# Altium project dsau-motherboard-revA.PrjPcb (part 2 of 2)

## Sheet dsau-micro-zed-bank35.SchDoc: dSAU Motherboard - uZed BANK35
size Letter; Engineer: Christopher J. Woodall; Organization: Boston University EDF/ECE; DocumentNumber: 9; Revision: A; SheetNumber: 9; SheetTotal: 10; EMAIL: cwoodall@bu.edu; TeamName: Team 19; ProjectName: dSAU
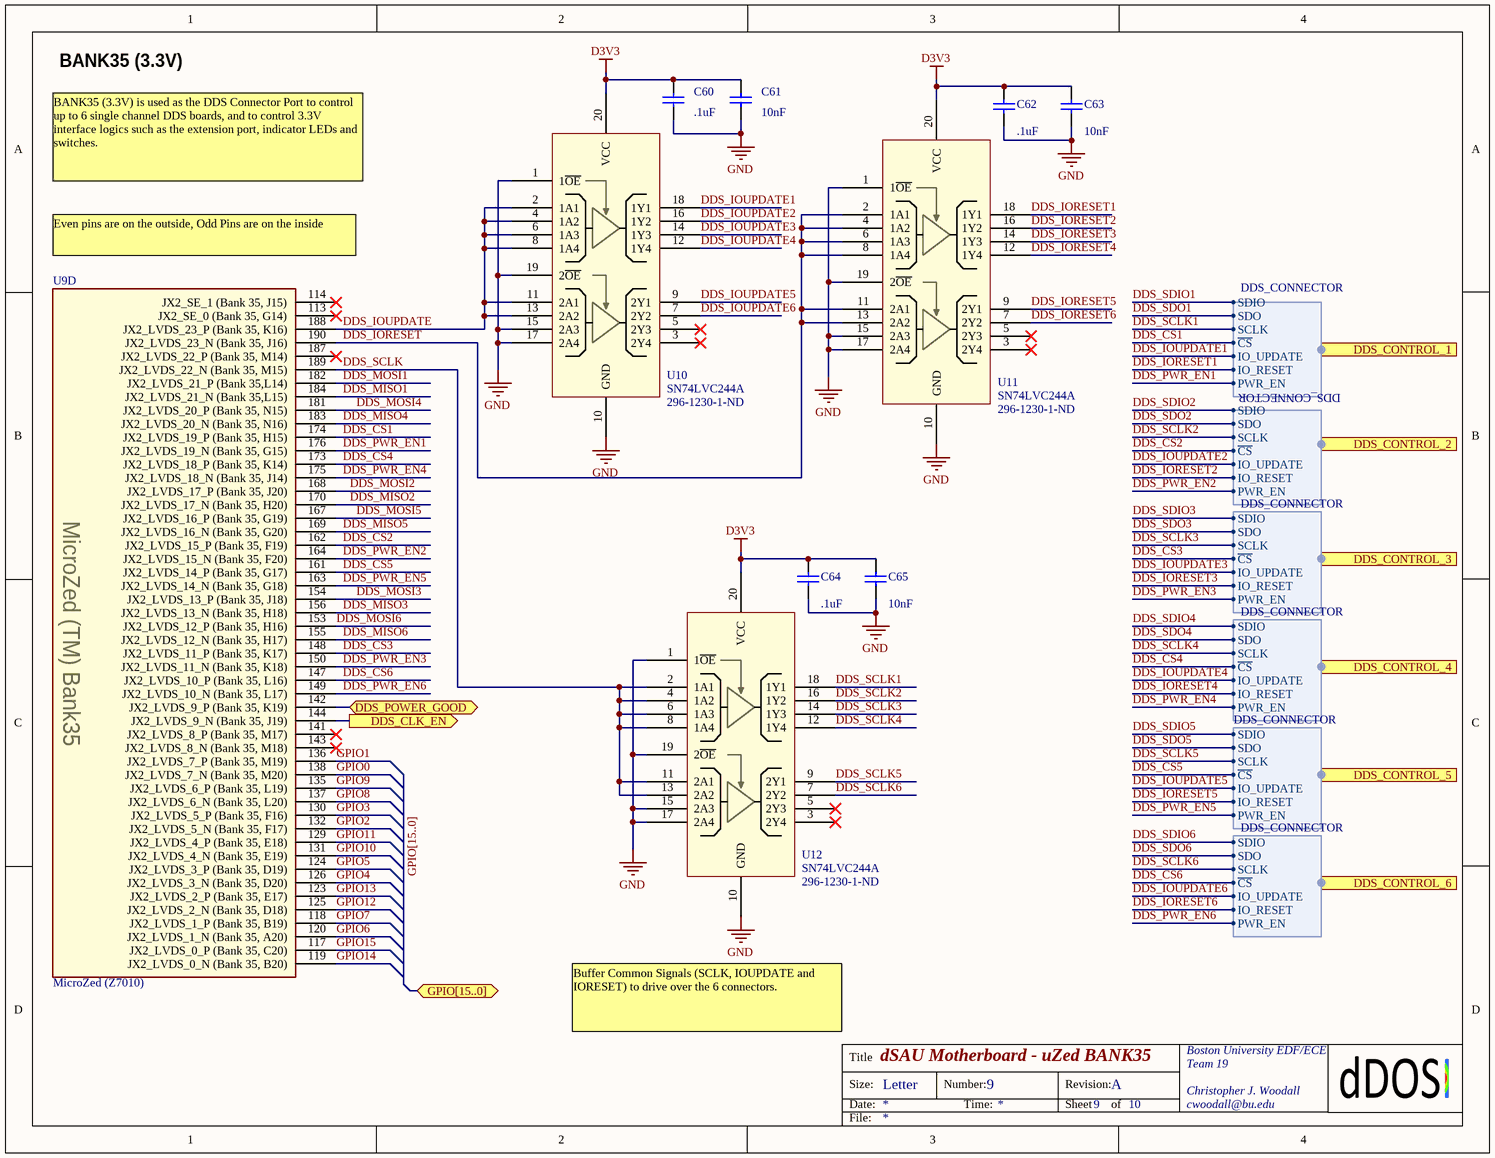
[diagram p6: dsau-micro-zed-bank35.SchDoc]

### Parts
C60  value .1uF  [CAPC1608L]  (hidden comment: CER 0.1UF 50V Y5V)
C61  value 10nF  [CAPC1608L]  (hidden comment: CER 10NF 25V 10% NP0)
C62  value .1uF  [CAPC1608L]  (hidden comment: CER 0.1UF 50V Y5V)
C63  value 10nF  [CAPC1608L]  (hidden comment: CER 10NF 25V 10% NP0)
C64  value .1uF  [CAPC1608L]  (hidden comment: CER 0.1UF 50V Y5V)
C65  value 10nF  [CAPC1608L]  (hidden comment: CER 10NF 25V 10% NP0)
U9  MicroZed (Z7010)  [MicroZed_MatingSide]  (part D of 5)
U10  SN74LVC244A  Supplier Part Number 1: 296-1230-1-ND  [TSOP64P640X120-20N]
U11  SN74LVC244A  Supplier Part Number 1: 296-1230-1-ND  [TSOP64P640X120-20N]
U12  SN74LVC244A  Supplier Part Number 1: 296-1230-1-ND  [TSOP64P640X120-20N]

### Ports
DDS_CLK_EN (out), DDS_CONTROL_1 (harness DDS_CONNECTOR), DDS_CONTROL_2 (harness DDS_CONNECTOR), DDS_CONTROL_3 (harness DDS_CONNECTOR), DDS_CONTROL_4 (harness DDS_CONNECTOR), DDS_CONTROL_5 (harness DDS_CONNECTOR), DDS_CONTROL_6 (harness DDS_CONNECTOR), DDS_POWER_GOOD, GPIO[15..0] (bidir)

### Harnesses
DDS_CONNECTOR: SDIO, SDO, SCLK, ~{CS}, IO_UPDATE, IO_RESET, PWR_EN

### Nets
D3V3: C60.2 C61.1 C62.2 C63.1 C64.2 C65.1 U10.20(VCC) U11.20(VCC) U12.20(VCC)
GND: C60.1 C61.2 C62.1 C63.2 C64.1 C65.2 U10.1(1~{OE}) U10.10(GND) U10.15(2A3) U10.17(2A4) U10.19(2~{OE}) U11.1(1~{OE}) U11.10(GND) U11.15(2A3) U11.17(2A4) U11.19(2~{OE}) U12.1(1~{OE}) U12.10(GND) U12.15(2A3) U12.17(2A4) U12.19(2~{OE})
DDS_CS1: U9.174(JX2_LVDS_19_P_(Bank_35,_H15)) ; port DDS_CONTROL_1.~{CS}
DDS_CS2: U9.162(JX2_LVDS_15_P_(Bank_35,_F19)) ; port DDS_CONTROL_2.~{CS}
DDS_CS3: U9.148(JX2_LVDS_11_P_(Bank_35,_K17)) ; port DDS_CONTROL_3.~{CS}
DDS_CS4: U9.173(JX2_LVDS_18_P_(Bank_35,_K14)) ; port DDS_CONTROL_4.~{CS}
DDS_CS5: U9.161(JX2_LVDS_14_P_(Bank_35,_G17)) ; port DDS_CONTROL_5.~{CS}
DDS_CS6: U9.147(JX2_LVDS_10_P_(Bank_35,_L16)) ; port DDS_CONTROL_6.~{CS}
DDS_IORESET: U9.190(JX2_LVDS_23_N_(Bank_35,_J16)) U11.2(1A1) U11.4(1A2) U11.6(1A3) U11.8(1A4) U11.11(2A1) U11.13(2A2)
DDS_IORESET1: U11.18(1Y1) ; port DDS_CONTROL_1.IO_RESET
DDS_IORESET2: U11.16(1Y2) ; port DDS_CONTROL_2.IO_RESET
DDS_IORESET3: U11.14(1Y3) ; port DDS_CONTROL_3.IO_RESET
DDS_IORESET4: U11.12(1Y4) ; port DDS_CONTROL_4.IO_RESET
DDS_IORESET5: U11.9(2Y1) ; port DDS_CONTROL_5.IO_RESET
DDS_IORESET6: U11.7(2Y2) ; port DDS_CONTROL_6.IO_RESET
DDS_IOUPDATE: U9.188(JX2_LVDS_23_P_(Bank_35,_K16)) U10.2(1A1) U10.4(1A2) U10.6(1A3) U10.8(1A4) U10.11(2A1) U10.13(2A2)
DDS_IOUPDATE1: U10.18(1Y1) ; port DDS_CONTROL_1.IO_UPDATE
DDS_IOUPDATE2: U10.16(1Y2) ; port DDS_CONTROL_2.IO_UPDATE
DDS_IOUPDATE3: U10.14(1Y3) ; port DDS_CONTROL_3.IO_UPDATE
DDS_IOUPDATE4: U10.12(1Y4) ; port DDS_CONTROL_4.IO_UPDATE
DDS_IOUPDATE5: U10.9(2Y1) ; port DDS_CONTROL_5.IO_UPDATE
DDS_IOUPDATE6: U10.7(2Y2) ; port DDS_CONTROL_6.IO_UPDATE
DDS_MISO1: U9.184(JX2_LVDS_21_N_(Bank_35,L15))
DDS_MISO2: U9.170(JX2_LVDS_17_N_(Bank_35,_H20))
DDS_MISO3: U9.156(JX2_LVDS_13_N_(Bank_35,_H18))
DDS_MISO4: U9.183(JX2_LVDS_20_N_(Bank_35,_N16))
DDS_MISO5: U9.169(JX2_LVDS_16_N_(Bank_35,_G20))
DDS_MISO6: U9.155(JX2_LVDS_12_N_(Bank_35,_H17))
DDS_MOSI1: U9.182(JX2_LVDS_21_P_(Bank_35,L14))
DDS_MOSI2: U9.168(JX2_LVDS_17_P_(Bank_35,_J20))
DDS_MOSI3: U9.154(JX2_LVDS_13_P_(Bank_35,_J18))
DDS_MOSI4: U9.181(JX2_LVDS_20_P_(Bank_35,_N15))
DDS_MOSI5: U9.167(JX2_LVDS_16_P_(Bank_35,_G19))
DDS_MOSI6: U9.153(JX2_LVDS_12_P_(Bank_35,_H16))
DDS_PWR_EN1: U9.176(JX2_LVDS_19_N_(Bank_35,_G15)) ; port DDS_CONTROL_1.PWR_EN
DDS_PWR_EN2: U9.164(JX2_LVDS_15_N_(Bank_35,_F20)) ; port DDS_CONTROL_2.PWR_EN
DDS_PWR_EN3: U9.150(JX2_LVDS_11_N_(Bank_35,_K18)) ; port DDS_CONTROL_3.PWR_EN
DDS_PWR_EN4: U9.175(JX2_LVDS_18_N_(Bank_35,_J14)) ; port DDS_CONTROL_4.PWR_EN
DDS_PWR_EN5: U9.163(JX2_LVDS_14_N_(Bank_35,_G18)) ; port DDS_CONTROL_5.PWR_EN
DDS_PWR_EN6: U9.149(JX2_LVDS_10_N_(Bank_35,_L17)) ; port DDS_CONTROL_6.PWR_EN
DDS_SCLK: U9.189(JX2_LVDS_22_N_(Bank_35,_M15)) U12.2(1A1) U12.4(1A2) U12.6(1A3) U12.8(1A4) U12.11(2A1) U12.13(2A2)
DDS_SCLK1: U12.18(1Y1) ; port DDS_CONTROL_1.SCLK
DDS_SCLK2: U12.16(1Y2) ; port DDS_CONTROL_2.SCLK
DDS_SCLK3: U12.14(1Y3) ; port DDS_CONTROL_3.SCLK
DDS_SCLK4: U12.12(1Y4) ; port DDS_CONTROL_4.SCLK
DDS_SCLK5: U12.9(2Y1) ; port DDS_CONTROL_5.SCLK
DDS_SCLK6: U12.7(2Y2) ; port DDS_CONTROL_6.SCLK
GPIO0: U9.138(JX2_LVDS_7_N_(Bank_35,_M20))
GPIO1: U9.136(JX2_LVDS_7_P_(Bank_35,_M19))
GPIO2: U9.132(JX2_LVDS_5_N_(Bank_35,_F17))
GPIO3: U9.130(JX2_LVDS_5_P_(Bank_35,_F16))
GPIO4: U9.126(JX2_LVDS_3_N_(Bank_35,_D20))
GPIO5: U9.124(JX2_LVDS_3_P_(Bank_35,_D19))
GPIO6: U9.120(JX2_LVDS_1_N_(Bank_35,_A20))
GPIO7: U9.118(JX2_LVDS_1_P_(Bank_35,_B19))
GPIO8: U9.137(JX2_LVDS_6_N_(Bank_35,_L20))
GPIO9: U9.135(JX2_LVDS_6_P_(Bank_35,_L19))
GPIO10: U9.131(JX2_LVDS_4_N_(Bank_35,_E19))
GPIO11: U9.129(JX2_LVDS_4_P_(Bank_35,_E18))
GPIO12: U9.125(JX2_LVDS_2_N_(Bank_35,_D18))
GPIO13: U9.123(JX2_LVDS_2_P_(Bank_35,_E17))
GPIO14: U9.119(JX2_LVDS_0_N_(Bank_35,_B20))
GPIO15: U9.117(JX2_LVDS_0_P_(Bank_35,_C20))
NetJ1_1_8: U9.142(JX2_LVDS_9_P_(Bank_35,_K19)) ; port DDS_POWER_GOOD
NetJP5_3: U9.144(JX2_LVDS_9_N_(Bank_35,_J19)) ; port DDS_CLK_EN

Not connected (* = marked no-connect by the designer): U9 113(JX2_SE_0_(Bank_35,_G14))* 114(JX2_SE_1_(Bank_35,_J15))* 141(JX2_LVDS_8_P_(Bank_35,_M17))* 143(JX2_LVDS_8_N_(Bank_35,_M18))* 187(JX2_LVDS_22_P_(Bank_35,_M14))*; U10 3(2Y4)* 5(2Y3)*; U11 3(2Y4)* 5(2Y3)*; U12 3(2Y4)* 5(2Y3)*

### Buses and harness runs
bus GPIO[15..0] = port GPIO[15..0]

### Notes on the sheet
- BANK35 (3.3V)
- BANK35 (3.3V) is used as the DDS Connector Port to control up to 6 single channel DDS boards, and to control 3.3V interface logics such as the extension port, indicator LEDs and switches.
- (near U9) Even pins are on the outside, Odd Pins are on the inside
- Buffer Common Signals (SCLK, IOUPDATE and IORESET) to drive over the 6 connectors.
- Title
- Size:
- Date:
- Letter
- Number:
- Time:
- Revision:
- Sheet
- of
- File:
- (in symbol MicroZed, part D) MicroZed (TM) Bank35

### Library data of the parts
C60 C62 C64 = Cap: as C5 on sheet dsau-adc; Published: 8-Jun-2000; LatestRevisionDate: 17-Jul-2002; LatestRevisionNote: Re-released for DXP Platform.; PackageReference: RAD-0.3; Publisher: Altium Limited; Supplier 1: Digi-Key; Supplier Part Number 1: 311-1343-1-ND
C61 C63 C65 = Cap: Capacitor; Manufacturer: Kemet; Manufacturer Part Number: C0603C103K3GACTU; Published: 8-Jun-2000; LatestRevisionDate: 17-Jul-2002; LatestRevisionNote: Re-released for DXP Platform.; PackageReference: RAD-0.3; Publisher: Altium Limited; Supplier 1: Digi-Key; Supplier Part Number 1: 399-8987-1-ND
U9 = MicroZed: MicroZed is a low-cost development board based on the Xilinx Zynq-7000 All Programmable SoC. Its unique design allows it to be used as both a stand-alone evaluation board for basic SoC experimentation, or combined with a carrier card as an embeddable syst; Manufacturer: Avnet; Manfacturer Part Number: AES-Z7MB-7Z010-G; Supplier 1: Avnet; Supplier Part Number 1: AES-Z7MB-7Z010-G; Supplier 2: Mouser; Supplier Part Number 2: 649-61083-101400LF
U10-U12 = SN74LVC244A: This octal buffer/line driver is operational at 1.5-V to  3.6-V V CC , but is designed specifically for 1.65-V to  3.6-V V CC operation; Manufacturer: Texas Instruments; Supplier 1: Digi-key; Manufacturer Part Number: SN74LVC244A

## Sheet dsau-dds-connector.SchDoc: dSAU Motherboard - DDS Connector
size Letter; Engineer: Christopher J. Woodall; Organization: Boston University EDF/ECE; DocumentNumber: 6; Revision: A; SheetNumber: 6; SheetTotal: 10; EMAIL: cwoodall@bu.edu; TeamName: Team 19; ProjectName: dSAU
Used 6 times, as channels DDSCONN1, DDSCONN2, DDSCONN3, DDSCONN4, DDSCONN5, DDSCONN6. Parts and nets are listed once, with the designators drawn on the sheet.
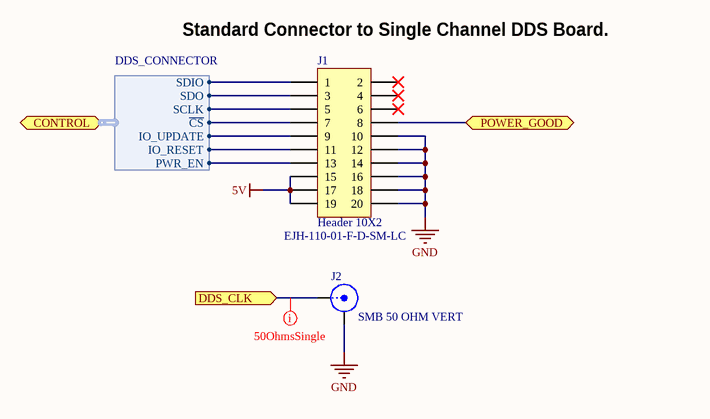
[diagram p7: dsau-dds-connector.SchDoc]

### Parts
J1  Header 10X2  Supplier Part Number 1: EJH-110-01-F-D-SM-LC  [HDR2X10]
J2  SMB 50 OHM VERT  [MOLEX_SMBVERT_731000207]

### Ports
CONTROL (harness DDS_CONNECTOR), DDS_CLK (in), POWER_GOOD

### Harnesses
DDS_CONNECTOR: SDIO, SDO, SCLK, ~{CS}, IO_UPDATE, IO_RESET, PWR_EN

### Nets
5V: J1.15 J1.17 J1.19
GND: J1.10 J1.12 J1.14 J1.16 J1.18 J1.20 J2.2(Y)
DDS_CLK: J2.1(X) ; port DDS_CLK
POWER_GOOD: J1.8 ; port POWER_GOOD
NetJ1_1: J1.1 ; port CONTROL.SDIO
NetJ1_3: J1.3 ; port CONTROL.SDO
NetJ1_5: J1.5 ; port CONTROL.SCLK
NetJ1_7: J1.7 ; port CONTROL.~{CS}
NetJ1_9: J1.9 ; port CONTROL.IO_UPDATE
NetJ1_11: J1.11 ; port CONTROL.IO_RESET
NetJ1_13: J1.13 ; port CONTROL.PWR_EN

Not connected (* = marked no-connect by the designer): J1 2* 4* 6*

### Channels
DDSCONN1: designators end in _1; ports DDS_CLK=CLK_OUT0 POWER_GOOD=NetJ1_1_8
DDSCONN2: designators end in _2; ports DDS_CLK=CLK_OUT1 POWER_GOOD=NetJ1_1_8
DDSCONN3: designators end in _3; ports DDS_CLK=CLK_OUT2 POWER_GOOD=NetJ1_1_8
DDSCONN4: designators end in _4; ports DDS_CLK=CLK_OUT3 POWER_GOOD=NetJ1_1_8
DDSCONN5: designators end in _5; ports DDS_CLK=CLK_OUT4 POWER_GOOD=NetJ1_1_8
DDSCONN6: designators end in _6; ports DDS_CLK=CLK_OUT5 POWER_GOOD=NetJ1_1_8

### Layout directives
net class 50OhmsSingle: CLK_OUT0

### Notes on the sheet
- (near J1) Standard Connector to Single Channel DDS Board.
- Title
- Size:
- Date:
- Letter
- Number:
- Time:
- Revision:
- Sheet
- of
- File:

### Library data of the parts
J1 = Header 10X2: Header, 10-Pin, Dual row; Manufacturer: Samtec; LatestRevisionDate: 17-Jul-2002; LatestRevisionNote: Re-released for DXP Platform.; Publisher: Altium Limited; Manufacturer Part Number: EJH-110-01-F-D-SM-LC; Supplier 1: Samtec; Supplier Additional: Samtec; Supplier Part Number Alternative: HCSD-05-S-02.01-01-N
J2 = SMB: SMB Straight Connector; Manufacturer: Molex Inc; Manufacturer Part Number: 0731000207; LatestRevisionDate: 17-Jul-2002; LatestRevisionNote: Re-released for DXP Platform.; Publisher: Altium Limited; Supplier 1: Digi-Key; Supplier Part Number 1: WM5528-ND

## Sheet dsau-interfaces.SchDoc: dSAU Motherboard - LEDs/Switches
size Letter; Engineer: Christopher J. Woodall; Organization: Boston University EDF/ECE; DocumentNumber: 10; Revision: A; SheetNumber: 10; SheetTotal: 10; EMAIL: cwoodall@bu.edu; TeamName: Team 19; ProjectName: dSAU
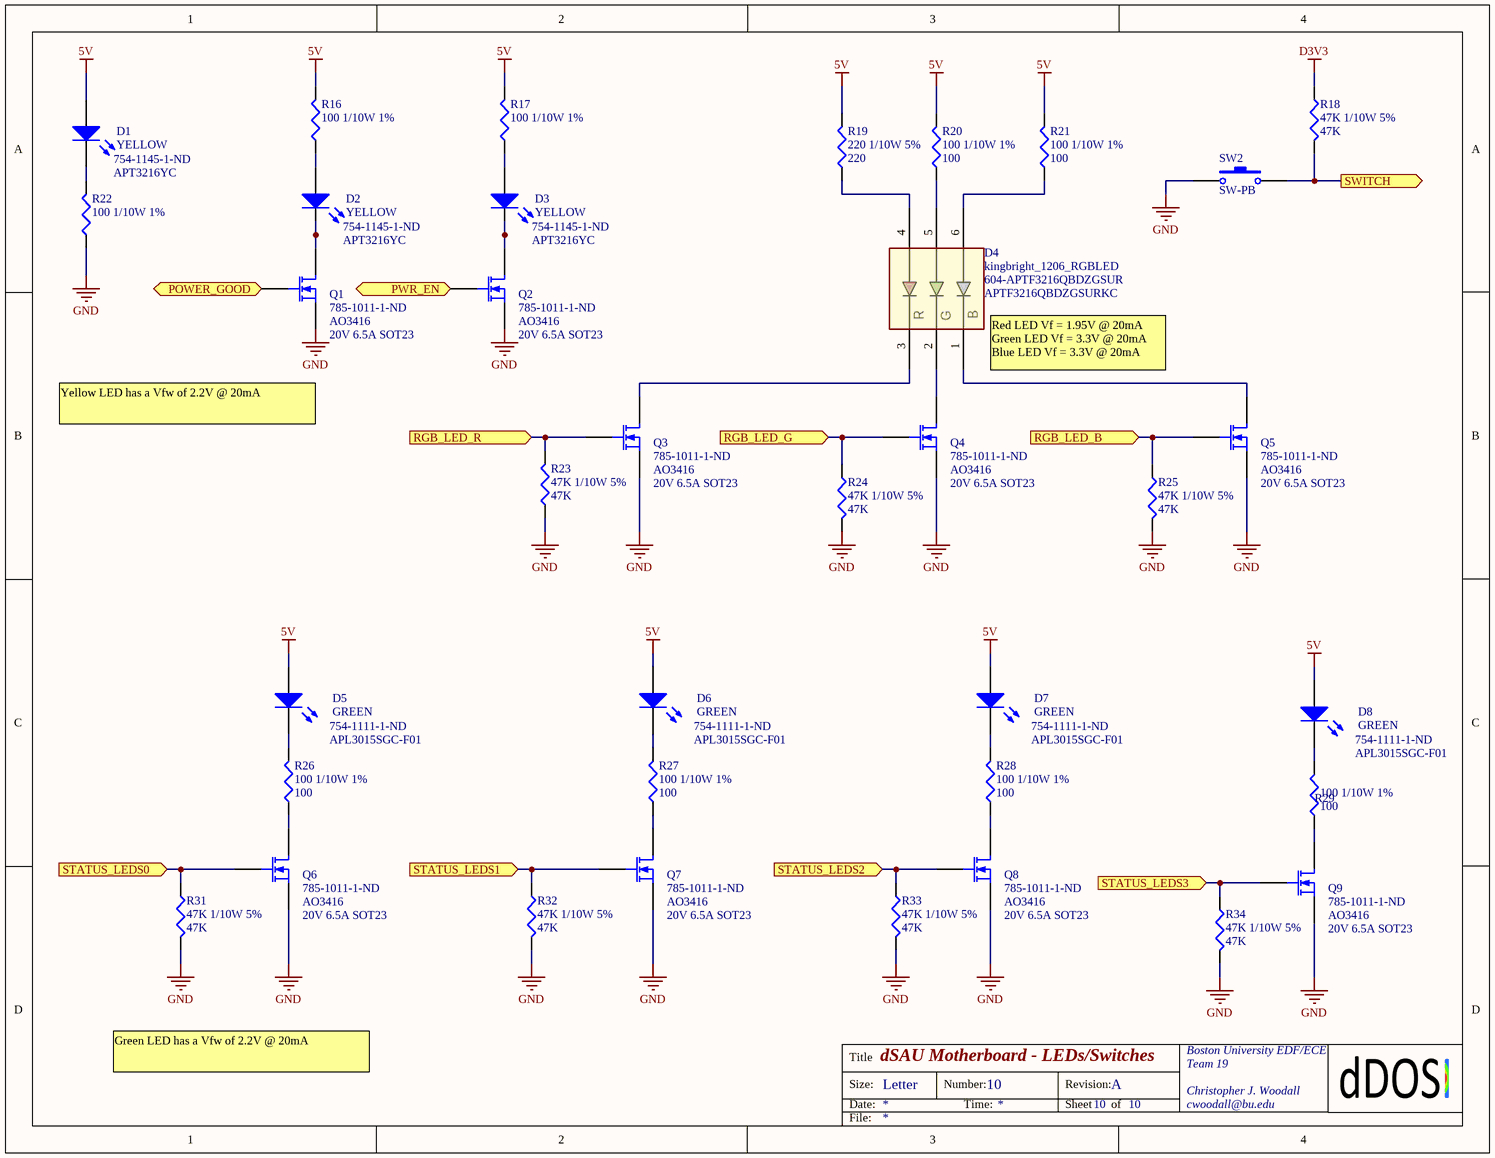
[diagram p8: dsau-interfaces.SchDoc]

### Parts
D1  YELLOW  Manufacturer Part Number: APT3216YC  Supplier Part Number 1: 754-1145-1-ND  [LED3216X08M]
D2  YELLOW  Manufacturer Part Number: APT3216YC  Supplier Part Number 1: 754-1145-1-ND  [LED3216X08M]
D3  YELLOW  Manufacturer Part Number: APT3216YC  Supplier Part Number 1: 754-1145-1-ND  [LED3216X08M]
D4  kingbright_1206_RGBLED  Supplier Part Number 1: 604-APTF3216QBDZGSUR  Manufacturer Part Number: APTF3216QBDZGSURKC  [RGBLED_1206_KINGSBRIGHT]
D5  GREEN  Manufacturer Part Number: APL3015SGC-F01  Supplier Part Number 1: 754-1111-1-ND  [LED3216X08M]
D6  GREEN  Manufacturer Part Number: APL3015SGC-F01  Supplier Part Number 1: 754-1111-1-ND  [LED3216X08M]
D7  GREEN  Manufacturer Part Number: APL3015SGC-F01  Supplier Part Number 1: 754-1111-1-ND  [LED3216X08M]
D8  GREEN  Manufacturer Part Number: APL3015SGC-F01  Supplier Part Number 1: 754-1111-1-ND  [LED3216X08M]
Q1  20V 6.5A SOT23  Manufacturer Part Number: AO3416  Supplier Part Number 1: 785-1011-1-ND  [SOT95P305X200-3M]
Q2  20V 6.5A SOT23  Manufacturer Part Number: AO3416  Supplier Part Number 1: 785-1011-1-ND  [SOT95P305X200-3M]
Q3  20V 6.5A SOT23  Manufacturer Part Number: AO3416  Supplier Part Number 1: 785-1011-1-ND  [SOT95P305X200-3M]
Q4  20V 6.5A SOT23  Manufacturer Part Number: AO3416  Supplier Part Number 1: 785-1011-1-ND  [SOT95P305X200-3M]
Q5  20V 6.5A SOT23  Manufacturer Part Number: AO3416  Supplier Part Number 1: 785-1011-1-ND  [SOT95P305X200-3M]
Q6  20V 6.5A SOT23  Manufacturer Part Number: AO3416  Supplier Part Number 1: 785-1011-1-ND  [SOT95P305X200-3M]
Q7  20V 6.5A SOT23  Manufacturer Part Number: AO3416  Supplier Part Number 1: 785-1011-1-ND  [SOT95P305X200-3M]
Q8  20V 6.5A SOT23  Manufacturer Part Number: AO3416  Supplier Part Number 1: 785-1011-1-ND  [SOT95P305X200-3M]
Q9  20V 6.5A SOT23  Manufacturer Part Number: AO3416  Supplier Part Number 1: 785-1011-1-ND  [SOT95P305X200-3M]
R16  100 1/10W 1%  [RESC1608L]
R17  100 1/10W 1%  [RESC1608L]
R18  47K 1/10W 5%  value 47K  [RESC1608L]
R19  220 1/10W 5%  value 220  [RESC1608L]
R20  100 1/10W 1%  value 100  [RESC1608L]
R21  100 1/10W 1%  value 100  [RESC1608L]
R22  100 1/10W 1%  [RESC1608L]
R23  47K 1/10W 5%  value 47K  [RESC1608L]
R24  47K 1/10W 5%  value 47K  [RESC1608L]
R25  47K 1/10W 5%  value 47K  [RESC1608L]
R26  100 1/10W 1%  value 100  [RESC1608L]
R27  100 1/10W 1%  value 100  [RESC1608L]
R28  100 1/10W 1%  value 100  [RESC1608L]
R29  100 1/10W 1%  value 100  [RESC1608L]
R31  47K 1/10W 5%  value 47K  [RESC1608L]
R32  47K 1/10W 5%  value 47K  [RESC1608L]
R33  47K 1/10W 5%  value 47K  [RESC1608L]
R34  47K 1/10W 5%  value 47K  [RESC1608L]
SW2  SW-PB  [SPST_SW_FSM4JH]

### Ports
POWER_GOOD (in), PWR_EN (in), RGB_LED_B (in), RGB_LED_G (in), RGB_LED_R (in), STATUS_LEDS0 (in), STATUS_LEDS1 (in), STATUS_LEDS2 (in), STATUS_LEDS3 (in), SWITCH (out)

### Nets
5V: D1.1(A) D5.1(A) D6.1(A) D7.1(A) D8.1(A) R16.2 R17.2 R19.2 R20.2 R21.2
D3V3: R18.1
GND: Q1.2(S) Q2.2(S) Q3.2(S) Q4.2(S) Q5.2(S) Q6.2(S) Q7.2(S) Q8.2(S) Q9.2(S) R22.1 R23.1 R24.2 R25.2 R31.2 R32.2 R33.2 R34.2 SW2.2
POWER_GOOD: Q1.1(G) ; port POWER_GOOD
PWR_EN: Q2.1(G) ; port PWR_EN
NetD1_2: D1.2(K) R22.2
NetD2_1: D2.1(A) R16.1
NetD2_2: D2.2(K) Q1.3(D)
NetD3_1: D3.1(A) R17.1
NetD3_2: D3.2(K) Q2.3(D)
NetD4_1: D4.1(B_N) Q5.3(D)
NetD4_2: D4.2(G_N) Q4.3(D)
NetD4_3: D4.3(R_N) Q3.3(D)
NetD4_4: D4.4(R_P) R19.1
NetD4_5: D4.5(G_P) R20.1
NetD4_6: D4.6(B_P) R21.1
NetD5_2: D5.2(K) R26.2
NetD6_2: D6.2(K) R27.2
NetD7_2: D7.2(K) R28.2
NetD8_2: D8.2(K) R29.2
NetQ3_1: Q3.1(G) R23.2 ; port RGB_LED_R
NetQ4_1: Q4.1(G) R24.1 ; port RGB_LED_G
NetQ5_1: Q5.1(G) R25.1 ; port RGB_LED_B
NetQ6_1: Q6.1(G) R31.1 ; port STATUS_LEDS0
NetQ6_3: Q6.3(D) R26.1
NetQ7_1: Q7.1(G) R32.1 ; port STATUS_LEDS1
NetQ7_3: Q7.3(D) R27.1
NetQ8_1: Q8.1(G) R33.1 ; port STATUS_LEDS2
NetQ8_3: Q8.3(D) R28.1
NetQ9_1: Q9.1(G) R34.1 ; port STATUS_LEDS3
NetQ9_3: Q9.3(D) R29.1
NetR18_2: R18.2 SW2.1 ; port SWITCH

### Notes on the sheet
- (near D4) Red LED Vf = 1.95V @ 20mA
  Green LED Vf = 3.3V @ 20mA
  Blue LED Vf = 3.3V @ 20mA
- Yellow LED has a Vfw of 2.2V @ 20mA
- Green LED has a Vfw of 2.2V @ 20mA
- Title
- Size:
- Date:
- Letter
- Number:
- Time:
- Revision:
- Sheet
- of
- File:
- (in symbol kingbright_1206_RGBLED) R; G; B

### Library data of the parts
D1-D3 D5-D8 = LED0: Typical INFRARED GaAs LED; Manufacturer: Kingbright Company LLC; Published: 8-Jun-2000; LatestRevisionDate: 08-Jul-2005; LatestRevisionNote: Mech Layer 1 removed.; PackageReference: LED-0; Publisher: Altium Limited; Supplier 1: Digi-Key
D4 = kingbright_1206_RGBLED: The Blue source color devices are made with InGaN Light     Emitting Diode.     The Green source color devices are made with InGaN     on Sapphire Light Emitting Diode.     The Hyper Red source color devices are made with Al-  GaInP on GaAs substrate Ligh; Supplier 1: Mouser; Manufacturer: Kingbright
Q1-Q9 = MOSFET-N: N-Channel MOSFET 1.8V Logic Level; Manufacturer: Alpha & Omega Semiconductor Inc; Value: AO3416; Published: 8-Jun-2000; LatestRevisionDate: 17-Jul-2002; LatestRevisionNote: Re-released for DXP Platform.; PackageVersion: 1995/1996; PackageReference: E3; Publisher: Altium Limited; Supplier 1: Digi-Key
R16 R17 R22 = Res3: Resistor; Manufacturer: Yageo; Manufacturer Part Number: RC0603FR-07100RL; Value: 470; Published: 8-Jun-2000; LatestRevisionDate: 29-May-2009; LatestRevisionNote: IPC-7351 Footprint Added.; PackageReference: J1-0603; Publisher: Altium Limited; PackageDescription: Chip Resistor; Supplier 1: Digi-Key; Supplier Part Number 1: 311-100HRCT-ND
R18 R23-R25 R31-R34 = Res3: as R5 on sheet dsau-motherboard-top; Published: 8-Jun-2000; LatestRevisionDate: 29-May-2009; LatestRevisionNote: IPC-7351 Footprint Added.; PackageReference: J1-0603; Publisher: Altium Limited; PackageDescription: Chip Resistor; Supplier 1: Digi-Key; Supplier Part Number 1: 311-47KGRTR-ND
R19 = Res3: Resistor; Manufacturer: Yageo; Manufacturer Part Number: RC0603FR-07220RL; Published: 8-Jun-2000; LatestRevisionDate: 29-May-2009; LatestRevisionNote: IPC-7351 Footprint Added.; PackageReference: J1-0603; Publisher: Altium Limited; PackageDescription: Chip Resistor; Supplier 1: Digi-Key; Supplier Part Number 1: 311-220HRCT-ND
R20 R21 R26-R29 = Res3: as R3 on sheet dsau-adc; Published: 8-Jun-2000; LatestRevisionDate: 29-May-2009; LatestRevisionNote: IPC-7351 Footprint Added.; PackageReference: J1-0603; Publisher: Altium Limited; PackageDescription: Chip Resistor; Supplier 1: Digi-Key; Supplier Part Number 1: 311-100HRCT-ND
SW2 = SW-PB: Switch; Manufacturer: TE Connectivity; Manufacturer Part Number: FSM4JH; Published: 24-Mar-1999; LatestRevisionDate: 17-Jul-2002; LatestRevisionNote: Re-released for DXP Platform.; PackageReference: SPST-2; Publisher: Altium Limited; Supplier 1: Digi-Key; Supplier Part Number 1: 450-1650-ND

## Sheet dsau-dds-clock.SchDoc: dSAU Motherboard - DDS Clock Gen.
size Letter; Engineer: Christopher J. Woodall; Organization: Boston University EDF/ECE; DocumentNumber: 5; Revision: A; SheetNumber: 5; SheetTotal: 10; EMAIL: cwoodall@bu.edu; TeamName: Team 19; ProjectName: dSAU
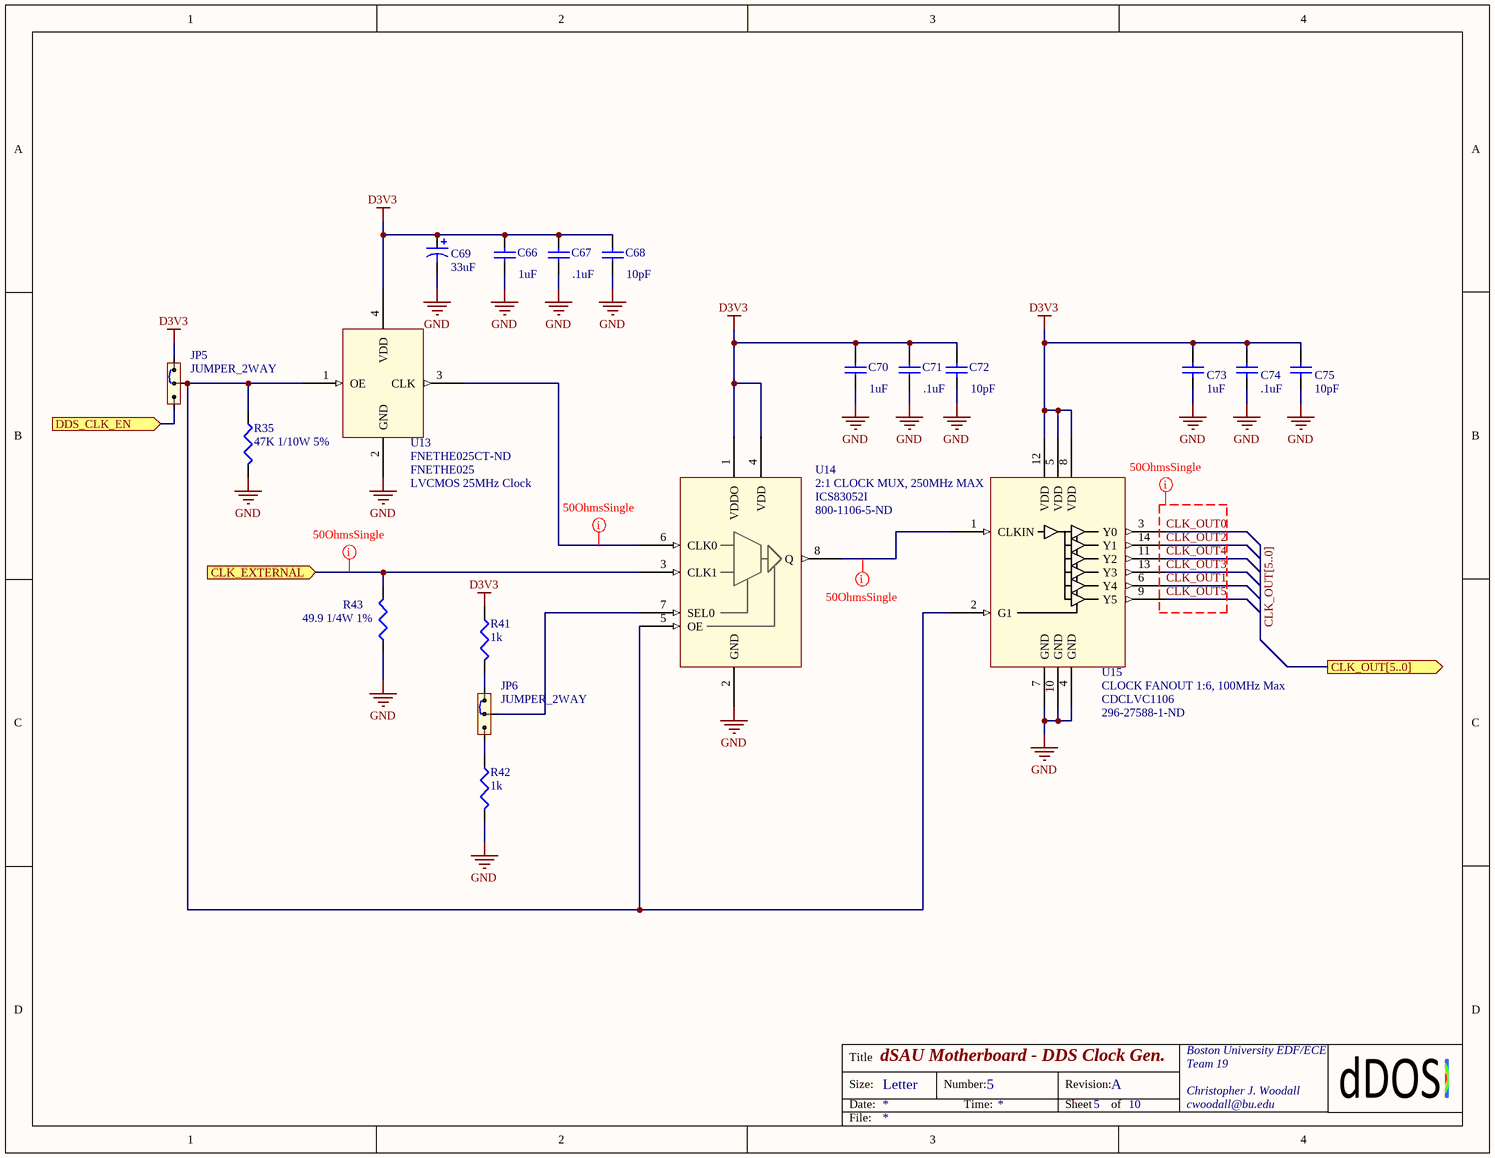
[diagram p9: dsau-dds-clock.SchDoc]

### Parts
C66  value 1uF  [CAPC2012L]  (hidden comment: CER 1UF 16V 10% X7R)
C67  value .1uF  [CAPC1608L]  (hidden comment: CER 0.1UF 50V Y5V)
C68  value 10pF  [CAPC1608L]  (hidden comment: CER 10PF 50V 5% NP0)
C69  value 33uF  [CAPC2012L]  (hidden comment: TANT 33UF 6.3V 10%)
C70  value 1uF  [CAPC2012L]  (hidden comment: CER 1UF 16V 10% X7R)
C71  value .1uF  [CAPC1608L]  (hidden comment: CER 0.1UF 50V Y5V)
C72  value 10pF  [CAPC1608L]  (hidden comment: CER 10PF 50V 5% NP0)
C73  value 1uF  [CAPC2012L]  (hidden comment: CER 1UF 16V 10% X7R)
C74  value .1uF  [CAPC1608L]  (hidden comment: CER 0.1UF 50V Y5V)
C75  value 10pF  [CAPC1608L]  (hidden comment: CER 10PF 50V 5% NP0)
JP5  JUMPER_2WAY  [HDR1X3]
JP6  JUMPER_2WAY  [HDR1X3]
R35  47K 1/10W 5%  [RESC1608L]
R41  value 1k  [RESC1608L]  (hidden comment: 100 1/10W 1%)
R42  value 1k  [RESC1608L]  (hidden comment: 100 1/10W 1%)
R43  49.9 1/4W 1%  [RESC3216L]
U13  LVCMOS 25MHz Clock  Supplier Part Number 1: FNETHE025CT-ND  [FNETHE025_4SMD]
U14  2:1 CLOCK MUX, 250MHz MAX  Supplier Part Number 1: 800-1106-5-ND  [SOP65P780-8M]
U15  CLOCK FANOUT 1:6, 100MHz Max  Supplier Part Number 1: 296-27588-1-ND  [TSOP65P640-14AM]

### Ports
CLK_EXTERNAL (in), CLK_OUT[5..0] (out), DDS_CLK_EN (in)

### Nets
D3V3: C66.1 C67.1 C68.1 C69.1 C70.1 C71.1 C72.1 C73.1 C74.1 C75.1 JP5.1 R41.1 U13.4(VDD) U14.1(VDDO) U14.4(VDD) U15.5(VDD) U15.8(VDD) U15.12(VDD)
GND: C66.2 C67.2 C68.2 C69.2 C70.2 C71.2 C72.2 C73.2 C74.2 C75.2 R35.2 R42.2 R43.1 U13.2(GND) U14.2(GND) U15.4(GND) U15.7(GND) U15.10(GND)
CLK_OUT0: U15.3(Y0)
CLK_OUT1: U15.6(Y4)
CLK_OUT2: U15.14(Y1)
CLK_OUT3: U15.13(Y3)
CLK_OUT4: U15.11(Y2)
CLK_OUT5: U15.9(Y5)
NetJ3_1: R43.2 U14.3(CLK1) ; port CLK_EXTERNAL
NetJP5_2: JP5.2 R35.1 U13.1(OE) U14.5(OE) U15.2(G1)
NetJP5_3: JP5.3 ; port DDS_CLK_EN
NetJP6_1: JP6.1 R41.2
NetJP6_2: JP6.2 U14.7(SEL0)
NetJP6_3: JP6.3 R42.1
NetU13_3: U13.3(CLK) U14.6(CLK0)
NetU14_8: U14.8(Q) U15.1(CLKIN)

### Buses and harness runs
bus CLK_OUT[5..0] = port CLK_OUT[5..0]

### Layout directives
net class 50OhmsSingle: CLK_OUT0, CLK_OUT1, CLK_OUT2, CLK_OUT3, CLK_OUT4, CLK_OUT5, NetJ3_1, NetU13_3, NetU14_8

### Notes on the sheet
- Title
- Size:
- Date:
- Letter
- Number:
- Time:
- Revision:
- Sheet
- of
- File:

### Library data of the parts
C66 C70 C73 = Cap: Capacitor; Manufacturer: Yageo; Manufacturer Part Number: CC0805KKX7R7BB105; Published: 8-Jun-2000; LatestRevisionDate: 17-Jul-2002; LatestRevisionNote: Re-released for DXP Platform.; PackageReference: RAD-0.3; Publisher: Altium Limited; Supplier 1: Digi-Key; Supplier Part Number 1: 311-1365-1-ND
C67 C71 C74 = Cap: Capacitor; Manufacturer: Yageo; Manufacturer Part Number: CC0603ZRY5V9BB104; Published: 8-Jun-2000; LatestRevisionDate: 17-Jul-2002; LatestRevisionNote: Re-released for DXP Platform.; PackageReference: RAD-0.3; Publisher: Altium Limited; Supplier 1: Digi-Key; Supplier Part Number 1: 311-1343-1-ND
C68 C72 C75 = Cap: Capacitor; Manufacturer: Samsung Electro-Mechanics America, Inc; Manufacturer Part Number: CL10C100JB8NCNC; Published: 8-Jun-2000; LatestRevisionDate: 17-Jul-2002; LatestRevisionNote: Re-released for DXP Platform.; PackageReference: RAD-0.3; Publisher: Altium Limited; Supplier 1: Digi-Key; Supplier Part Number 1: 1276-2154-1-ND
C69 = Cap Pol3: Polarized Capacitor (Surface Mount); Manufacturer: AVX Corporation; Manufacturer Part Number: TPSA336K006R0600; Published: 8-Jun-2000; LatestRevisionDate: 29-May-2009; LatestRevisionNote: IPC-7351 Footprint Added.; PackageReference: C1206; Publisher: Altium Limited; PackageDescription: Chip Capacitor; Supplier 1: Digi-Key; Supplier Part Number 1: 478-1755-1-ND
R35 = Res3: Resistor; Manufacturer: Yageo; Manufacturer Part Number: 311-47kGRCT-ND; Published: 8-Jun-2000; LatestRevisionDate: 29-May-2009; LatestRevisionNote: IPC-7351 Footprint Added.; PackageReference: J1-0603; Publisher: Altium Limited; PackageDescription: Chip Resistor; Value: 47K; Supplier 1: Digi-Key; Supplier Part Number 1: 311-47KGRTR-ND
R41 R42 = Res3: Resistor; Manufacturer: Yageo; Manufacturer Part Number: RC0603JR-071KL; Published: 8-Jun-2000; LatestRevisionDate: 29-May-2009; LatestRevisionNote: IPC-7351 Footprint Added.; PackageReference: J1-0603; Publisher: Altium Limited; PackageDescription: Chip Resistor; Supplier 1: Digi-Key; Supplier Part Number 1: 311-1.0KGRCT-ND
R43 = Res3: Resistor; Manufacturer: Panasonic Electronic Components; Manufacturer Part Number: ERJ-8ENF49R9V; Value: 49.9; Published: 8-Jun-2000; LatestRevisionDate: 29-May-2009; LatestRevisionNote: IPC-7351 Footprint Added.; PackageReference: J1-0603; Publisher: Altium Limited; PackageDescription: Chip Resistor; Supplier 1: Digi-Key; Supplier Part Number 1: P49.9FCT-ND
U13 = FNETHE025: Manufacturer: Pericom; Supplier 1: Digi-Key; Manufacturer Part Number: FNETHE025
U14 = ICS83052I: Manufacturer: IDT; Supplier 1: Digi-Key; Manufacturer Part Number: ICS83052I
U15 = CDCLVC1106: Clock Fanout 1:6, 100MHz low-skew; Manufacturer: Texas Instruments; Supplier 1: Digi-Key; Manufacturer Part Number: CDCLVC1106

## Nets that join several sheets
5V: dsau-motherboard-top (C22.1 J4.1 J5.1 J9.1), dsau-power (11 pins), dsau-micro-zed (19 pins), DDSCONN1 (J1_1.15 J1_1.17 J1_1.19), dsau-interfaces (10 pins), DDSCONN2 (J1_2.15 J1_2.17 J1_2.19), DDSCONN3 (J1_3.15 J1_3.17 J1_3.19), DDSCONN4 (J1_4.15 J1_4.17 J1_4.19), DDSCONN5 (J1_5.15 J1_5.17 J1_5.19), DDSCONN6 (J1_6.15 J1_6.17 J1_6.19)
A3V3: dsau-adc (C6.1 C15.1 L1.2 L3.2), dsau-power (5 pins)
D1V8: dsau-adc (C4.1 L2.1), dsau-power (7 pins), dsau-micro-zed-bank34 (C76.2 U16.6)
D3V3: dsau-motherboard-top (J9.3 J10.6 R5.2), dsau-power (6 pins), dsau-micro-zed (C40.1 C55.1 L6.1 L7.1), dsau-micro-zed-bank34 (C77.1 U16.1), dsau-micro-zed-bank35 (9 pins), dsau-interfaces (R18.1), dsau-dds-clock (18 pins)
GND: dsau-motherboard-top (11 pins), dsau-adc (38 pins), ADC/AFE1 (C2_1.2 C3_1.1), ADC/AFE2 (C2_2.2 C3_2.1), dsau-power (37 pins), dsau-micro-zed (66 pins), dsau-micro-zed-bank34 (C76.1 C77.2 U16.2 U16.5), dsau-micro-zed-bank35 (21 pins), DDSCONN1 (7 pins), dsau-interfaces (18 pins), dsau-dds-clock (18 pins), DDSCONN2 (7 pins), DDSCONN3 (7 pins), DDSCONN4 (7 pins), DDSCONN5 (7 pins), DDSCONN6 (7 pins)
CLK_OUT0: DDSCONN1 (J2_1.1), dsau-dds-clock (U15.3)
CLK_OUT1: dsau-dds-clock (U15.6), DDSCONN2 (J2_2.1)
CLK_OUT2: dsau-dds-clock (U15.14), DDSCONN3 (J2_3.1)
CLK_OUT3: dsau-dds-clock (U15.13), DDSCONN4 (J2_4.1)
CLK_OUT4: dsau-dds-clock (U15.11), DDSCONN5 (J2_5.1)
CLK_OUT5: dsau-dds-clock (U15.9), DDSCONN6 (J2_6.1)
CLKOUT_N: dsau-adc (U2.56), dsau-micro-zed-bank34 (U9.81)
CLKOUT_P: dsau-adc (U2.57), dsau-micro-zed-bank34 (U9.83)
DA0_N: dsau-adc (U2.40), dsau-micro-zed-bank34 (U9.35)
DA0_P: dsau-adc (U2.41), dsau-micro-zed-bank34 (U9.37)
DA2_N: dsau-adc (U2.42), dsau-micro-zed-bank34 (U9.41)
DA2_P: dsau-adc (U2.43), dsau-micro-zed-bank34 (U9.43)
DA4_N: dsau-adc (U2.44), dsau-micro-zed-bank34 (U9.47)
DA4_P: dsau-adc (U2.45), dsau-micro-zed-bank34 (U9.49)
DA6_N: dsau-adc (U2.46), dsau-micro-zed-bank34 (U9.53)
DA6_P: dsau-adc (U2.47), dsau-micro-zed-bank34 (U9.55)
DA8_N: dsau-adc (U2.50), dsau-micro-zed-bank34 (U9.61)
DA8_P: dsau-adc (U2.51), dsau-micro-zed-bank34 (U9.63)
DA10_N: dsau-adc (U2.52), dsau-micro-zed-bank34 (U9.67)
DA10_P: dsau-adc (U2.53), dsau-micro-zed-bank34 (U9.69)
DA12_N: dsau-adc (U2.54), dsau-micro-zed-bank34 (U9.73)
DA12_P: dsau-adc (U2.55), dsau-micro-zed-bank34 (U9.75)
DB0_N: dsau-adc (U2.60), dsau-micro-zed-bank34 (U9.76)
DB0_P: dsau-adc (U2.61), dsau-micro-zed-bank34 (U9.74)
DB2_N: dsau-adc (U2.62), dsau-micro-zed-bank34 (U9.70)
DB2_P: dsau-adc (U2.63), dsau-micro-zed-bank34 (U9.68)
DB4_N: dsau-adc (U2.2), dsau-micro-zed-bank34 (U9.64)
DB4_P: dsau-adc (U2.3), dsau-micro-zed-bank34 (U9.62)
DB6_N: dsau-adc (U2.4), dsau-micro-zed-bank34 (U9.56)
DB6_P: dsau-adc (U2.5), dsau-micro-zed-bank34 (U9.54)
DB8_N: dsau-adc (U2.6), dsau-micro-zed-bank34 (U9.50)
DB8_P: dsau-adc (U2.7), dsau-micro-zed-bank34 (U9.48)
DB10_N: dsau-adc (U2.8), dsau-micro-zed-bank34 (U9.44)
DB10_P: dsau-adc (U2.9), dsau-micro-zed-bank34 (U9.42)
DB12_N: dsau-adc (U2.10), dsau-micro-zed-bank34 (U9.38)
DB12_P: dsau-adc (U2.11), dsau-micro-zed-bank34 (U9.36)
DDS_CS1: dsau-micro-zed-bank35 (U9.174), DDSCONN1 (J1_1.7)
DDS_CS2: dsau-micro-zed-bank35 (U9.162), DDSCONN2 (J1_2.7)
DDS_CS3: dsau-micro-zed-bank35 (U9.148), DDSCONN3 (J1_3.7)
DDS_CS4: dsau-micro-zed-bank35 (U9.173), DDSCONN4 (J1_4.7)
DDS_CS5: dsau-micro-zed-bank35 (U9.161), DDSCONN5 (J1_5.7)
DDS_CS6: dsau-micro-zed-bank35 (U9.147), DDSCONN6 (J1_6.7)
DDS_IORESET1: dsau-micro-zed-bank35 (U11.18), DDSCONN1 (J1_1.11)
DDS_IORESET2: dsau-micro-zed-bank35 (U11.16), DDSCONN2 (J1_2.11)
DDS_IORESET3: dsau-micro-zed-bank35 (U11.14), DDSCONN3 (J1_3.11)
DDS_IORESET4: dsau-micro-zed-bank35 (U11.12), DDSCONN4 (J1_4.11)
DDS_IORESET5: dsau-micro-zed-bank35 (U11.9), DDSCONN5 (J1_5.11)
DDS_IORESET6: dsau-micro-zed-bank35 (U11.7), DDSCONN6 (J1_6.11)
DDS_IOUPDATE1: dsau-micro-zed-bank35 (U10.18), DDSCONN1 (J1_1.9)
DDS_IOUPDATE2: dsau-micro-zed-bank35 (U10.16), DDSCONN2 (J1_2.9)
DDS_IOUPDATE3: dsau-micro-zed-bank35 (U10.14), DDSCONN3 (J1_3.9)
DDS_IOUPDATE4: dsau-micro-zed-bank35 (U10.12), DDSCONN4 (J1_4.9)
DDS_IOUPDATE5: dsau-micro-zed-bank35 (U10.9), DDSCONN5 (J1_5.9)
DDS_IOUPDATE6: dsau-micro-zed-bank35 (U10.7), DDSCONN6 (J1_6.9)
DDS_PWR_EN1: dsau-micro-zed-bank35 (U9.176), DDSCONN1 (J1_1.13)
DDS_PWR_EN2: dsau-micro-zed-bank35 (U9.164), DDSCONN2 (J1_2.13)
DDS_PWR_EN3: dsau-micro-zed-bank35 (U9.150), DDSCONN3 (J1_3.13)
DDS_PWR_EN4: dsau-micro-zed-bank35 (U9.175), DDSCONN4 (J1_4.13)
DDS_PWR_EN5: dsau-micro-zed-bank35 (U9.163), DDSCONN5 (J1_5.13)
DDS_PWR_EN6: dsau-micro-zed-bank35 (U9.149), DDSCONN6 (J1_6.13)
DDS_SCLK1: dsau-micro-zed-bank35 (U12.18), DDSCONN1 (J1_1.5)
DDS_SCLK2: dsau-micro-zed-bank35 (U12.16), DDSCONN2 (J1_2.5)
DDS_SCLK3: dsau-micro-zed-bank35 (U12.14), DDSCONN3 (J1_3.5)
DDS_SCLK4: dsau-micro-zed-bank35 (U12.12), DDSCONN4 (J1_4.5)
DDS_SCLK5: dsau-micro-zed-bank35 (U12.9), DDSCONN5 (J1_5.5)
DDS_SCLK6: dsau-micro-zed-bank35 (U12.7), DDSCONN6 (J1_6.5)
GPIO0: dsau-motherboard-top (J9.5), dsau-micro-zed-bank35 (U9.138)
GPIO1: dsau-motherboard-top (J9.7), dsau-micro-zed-bank35 (U9.136)
GPIO2: dsau-motherboard-top (J9.9), dsau-micro-zed-bank35 (U9.132)
GPIO3: dsau-motherboard-top (J9.11), dsau-micro-zed-bank35 (U9.130)
GPIO4: dsau-motherboard-top (J9.13), dsau-micro-zed-bank35 (U9.126)
GPIO5: dsau-motherboard-top (J9.15), dsau-micro-zed-bank35 (U9.124)
GPIO6: dsau-motherboard-top (J9.17), dsau-micro-zed-bank35 (U9.120)
GPIO7: dsau-motherboard-top (J9.19), dsau-micro-zed-bank35 (U9.118)
GPIO8: dsau-motherboard-top (J9.20), dsau-micro-zed-bank35 (U9.137)
GPIO9: dsau-motherboard-top (J9.18), dsau-micro-zed-bank35 (U9.135)
GPIO10: dsau-motherboard-top (J9.16), dsau-micro-zed-bank35 (U9.131)
GPIO11: dsau-motherboard-top (J9.14), dsau-micro-zed-bank35 (U9.129)
GPIO12: dsau-motherboard-top (J9.12), dsau-micro-zed-bank35 (U9.125)
GPIO13: dsau-motherboard-top (J9.10), dsau-micro-zed-bank35 (U9.123)
GPIO14: dsau-motherboard-top (J9.8), dsau-micro-zed-bank35 (U9.119)
GPIO15: dsau-motherboard-top (J9.6), dsau-micro-zed-bank35 (U9.117)
INPUTA_N: dsau-adc (U2.30), ADC/AFE1 (R2_1.1 T1_1.4)
INPUTA_P: dsau-adc (U2.29), ADC/AFE1 (R1_1.2 T1_1.5)
INPUTB_N: dsau-adc (U2.20), ADC/AFE2 (R2_2.1 T1_2.4)
INPUTB_P: dsau-adc (U2.19), ADC/AFE2 (R1_2.2 T1_2.5)
NetC1_1_1: dsau-motherboard-top (J6.1), ADC/AFE1 (C1_1.1)
NetC1_2_1: dsau-motherboard-top (J7.1), ADC/AFE2 (C1_2.1)
NetJ1_1_8: dsau-motherboard-top (R5.1), dsau-micro-zed-bank35 (U9.142), DDSCONN1 (J1_1.8), DDSCONN2 (J1_2.8), DDSCONN3 (J1_3.8), DDSCONN4 (J1_4.8), DDSCONN5 (J1_5.8), DDSCONN6 (J1_6.8)
NetJ3_1: dsau-motherboard-top (J3.1), dsau-dds-clock (R43.2 U14.3)
NetJ8_1: dsau-motherboard-top (J8.1), dsau-adc (R30.2 U3.3)
NetJP1_3: dsau-adc (JP1.3), dsau-micro-zed-bank34 (U9.84)
NetJP5_3: dsau-micro-zed-bank35 (U9.144), dsau-dds-clock (JP5.3)
NetQ3_1: dsau-micro-zed-bank34 (U9.23), dsau-interfaces (Q3.1 R23.2)
NetQ4_1: dsau-micro-zed-bank34 (U9.26), dsau-interfaces (Q4.1 R24.1)
NetQ5_1: dsau-micro-zed-bank34 (U9.29), dsau-interfaces (Q5.1 R25.1)
NetQ6_1: dsau-micro-zed-bank34 (U9.30), dsau-interfaces (Q6.1 R31.1)
NetQ7_1: dsau-micro-zed-bank34 (U9.32), dsau-interfaces (Q7.1 R32.1)
NetQ8_1: dsau-micro-zed-bank34 (U9.24), dsau-interfaces (Q8.1 R33.1)
NetQ9_1: dsau-micro-zed-bank34 (U9.31), dsau-interfaces (Q9.1 R34.1)
NetR18_2: dsau-micro-zed-bank34 (U9.25), dsau-interfaces (R18.2 SW2.1)
NetU2_12: dsau-adc (U2.12), dsau-micro-zed-bank34 (U9.20)
NetU2_13: dsau-adc (U2.13), dsau-micro-zed-bank34 (U9.18)
NetU2_14: dsau-adc (U2.14), dsau-micro-zed-bank34 (U9.14)
NetU2_15: dsau-adc (U2.15), dsau-micro-zed-bank34 (U9.12)
NetU2_35: dsau-adc (U2.35), dsau-micro-zed-bank34 (U9.11)
NetU2_36: dsau-adc (U2.36), dsau-micro-zed-bank34 (U9.17)
NetU2_37: dsau-adc (U2.37), dsau-micro-zed-bank34 (U9.19)
NetU2_64: dsau-adc (U2.64), dsau-micro-zed-bank34 (U16.4)
NetU8_3: dsau-power (U8.3), dsau-micro-zed (U9.110)
POWER_GOOD: dsau-power (JP3.1 SW1.1 U7.1), dsau-micro-zed (U9.111), dsau-interfaces (Q1.1)
PWR_EN: dsau-power (JP4.2 U4.1 U5.1 U6.1), dsau-interfaces (Q2.1)
TCK: dsau-motherboard-top (J10.4), dsau-micro-zed (U9.1)
TDI: dsau-motherboard-top (J10.2), dsau-micro-zed (U9.4)
TDO: dsau-motherboard-top (J10.3), dsau-micro-zed (U9.3)
TMS: dsau-motherboard-top (J10.1), dsau-micro-zed (U9.2)
VCM: dsau-adc (U2.23), ADC/AFE1 (C2_1.1 R1_1.1 R2_1.2), ADC/AFE2 (C2_2.1 R1_2.1 R2_2.2)